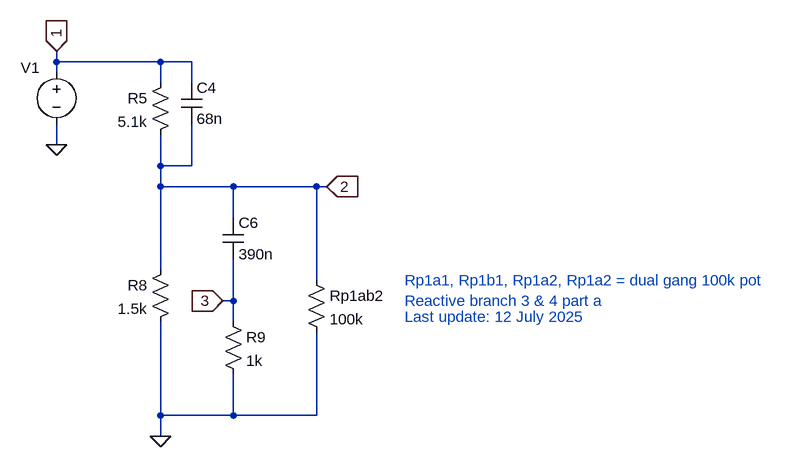
[diagram p0: schematic Reactive_branch_3a.asc]
Reactive_branch_3a.asc, the LTspice schematic file:
Version 4
SHEET 1 4496 5064
WIRE -112 2544 -112 2528
WIRE 48 2544 -112 2544
WIRE 96 2544 48 2544
WIRE -112 2560 -112 2544
WIRE 48 2576 48 2544
WIRE 96 2576 96 2544
WIRE -112 2672 -112 2640
WIRE 48 2704 48 2656
WIRE 96 2704 96 2640
WIRE 96 2704 48 2704
WIRE 48 2736 48 2704
WIRE 160 2736 48 2736
WIRE 288 2736 160 2736
WIRE 304 2736 288 2736
WIRE 160 2784 160 2736
WIRE 48 2864 48 2736
WIRE 288 2880 288 2736
WIRE 160 2912 160 2848
WIRE 160 2912 144 2912
WIRE 160 2944 160 2912
WIRE 48 3088 48 2944
WIRE 160 3088 160 3024
WIRE 160 3088 48 3088
WIRE 288 3088 288 2960
WIRE 288 3088 160 3088
WIRE 48 3120 48 3088
FLAG 48 3120 0
FLAG 144 2912 3
IOPIN 144 2912 In
FLAG 304 2736 2
IOPIN 304 2736 In
FLAG -112 2528 1
IOPIN -112 2528 In
FLAG -112 2672 0
SYMBOL res 64 2560 M0
SYMATTR InstName R5
SYMATTR Value 5.1k
SYMBOL res 64 2848 M0
SYMATTR InstName R8
SYMATTR Value 1.5k
SYMBOL cap 80 2576 R0
SYMATTR InstName C4
SYMATTR Value 68n
SYMBOL cap 144 2784 R0
SYMATTR InstName C6
SYMATTR Value 390n
SYMBOL res 144 2928 R0
SYMATTR InstName R9
SYMATTR Value 1k
SYMBOL res 272 2864 R0
SYMATTR InstName Rp1ab2
SYMATTR Value 100k
SYMBOL voltage -112 2544 R0
WINDOW 0 -55 9 Left 2
WINDOW 39 0 0 Left 0
WINDOW 3 -493 7 Left 2
SYMATTR InstName V1
SYMATTR Value ""
SYMATTR Value2 AC 1 0
TEXT 424 2880 Left 2 ;Rp1a1, Rp1b1, Rp1a2, Rp1a2 = dual gang 100k pot
TEXT 424 2912 Left 2 ;Reactive branch 3 & 4 part a
TEXT 424 2936 Left 2 ;Last update: 12 July 2025

The netlist it stands for:
* Reactive_branch_3a.asc
R5 1 2 5.1k
R8 2 0 1.5k
C4 1 2 68n
C6 2 3 390n
R9 3 0 1k
Rp1ab2 2 0 100k
V1 1 0 AC 1 0
* Rp1a1, Rp1b1, Rp1a2, Rp1a2 = dual gang 100k pot
* Reactive branch 3 & 4 part a
* Last update: 12 July 2025
.backanno
.end